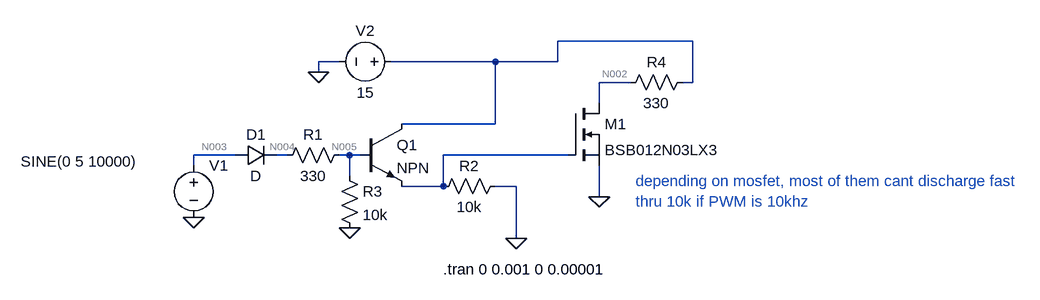
[diagram p0: schematic MOSFET_gate_discharge_via_pull_down.asc]
MOSFET_gate_discharge_via_pull_down.asc, the LTspice schematic file:
Version 4
SHEET 1 1380 680
WIRE 720 -16 512 -16
WIRE 176 16 144 16
WIRE 416 16 256 16
WIRE 512 16 512 -16
WIRE 512 16 416 16
WIRE 144 32 144 16
WIRE 624 48 576 48
WIRE 720 48 720 -16
WIRE 720 48 704 48
WIRE 576 80 576 48
WIRE 416 112 416 16
WIRE 416 112 272 112
WIRE 16 160 -48 160
WIRE 96 160 80 160
WIRE 192 160 176 160
WIRE 208 160 192 160
WIRE 528 160 336 160
WIRE -48 176 -48 160
WIRE 192 192 192 160
WIRE 336 208 336 160
WIRE 336 208 272 208
WIRE 448 208 416 208
WIRE 576 224 576 176
WIRE 448 288 448 208
FLAG -48 256 0
FLAG 144 32 0
FLAG 448 288 0
FLAG 192 272 0
FLAG 576 224 0
SYMBOL voltage -48 160 R0
WINDOW 3 -266 10 Left 2
WINDOW 123 0 0 Left 0
WINDOW 39 0 0 Left 0
SYMATTR Value SINE(0 5 10000)
SYMATTR InstName V1
SYMBOL res 192 144 R90
WINDOW 0 0 56 VBottom 2
WINDOW 3 32 56 VTop 2
SYMATTR InstName R1
SYMATTR Value 330
SYMBOL res 432 192 R90
WINDOW 0 0 56 VBottom 2
WINDOW 3 32 56 VTop 2
SYMATTR InstName R2
SYMATTR Value 10k
SYMBOL npn 208 112 R0
SYMATTR InstName Q1
SYMBOL diode 16 176 R270
WINDOW 0 32 32 VTop 2
WINDOW 3 0 32 VBottom 2
SYMATTR InstName D1
SYMBOL voltage 272 16 R90
WINDOW 0 -32 56 VBottom 2
WINDOW 3 32 56 VTop 2
WINDOW 123 0 0 Left 0
WINDOW 39 0 0 Left 0
SYMATTR InstName V2
SYMATTR Value 15
SYMBOL res 176 176 R0
SYMATTR InstName R3
SYMATTR Value 10k
SYMBOL nmos 528 80 R0
SYMATTR InstName M1
SYMATTR Value BSB012N03LX3
SYMBOL res 720 32 R90
WINDOW 0 0 56 VBottom 2
WINDOW 3 32 56 VTop 2
SYMATTR InstName R4
SYMATTR Value 330
TEXT 336 336 Left 2 !.tran 0 0.001 0 0.00001
TEXT 632 200 Left 2 ;depending on mosfet, most of them cant discharge fast\nthru 10k if PWM is 10khz

The netlist it stands for:
* MOSFET_gate_discharge_via_pull_down.asc
V1 N003 0 SINE(0 5 10000)
R1 N005 N004 330
R2 0 N006 10k
Q1 N001 N005 N006 0 NPN
D1 N003 N004 D
V2 N001 0 15
R3 N005 0 10k
M1 N002 N006 0 0 BSB012N03LX3
R4 N001 N002 330
.model D D
.lib standard.dio
.model NPN NPN
.model PNP PNP
.lib standard.bjt
.model NMOS NMOS
.model PMOS PMOS
.lib standard.mos
.tran 0 0.001 0 0.00001
* depending on mosfet, most of them cant discharge fast
* thru 10k if PWM is 10khz
.backanno
.end

* Results of the author's LTspice run, read from the files saved beside the schematic
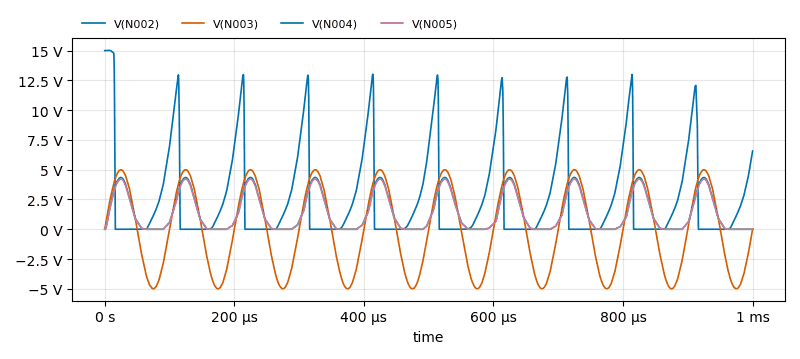
[diagram p1: Transient Analysis of MOSFET_gate_discharge_via_pull_down.asc, plotted from the saved traces]
* Transient Analysis, 1 run:
*   V(N002): min 95.77 µV, max 15.02 V, average 2.569 V, rms 4.693 V, last 6.569 V
*   V(N003): min -5 V, max 4.999 V, average 1.511 mV, rms 3.588 V, last 0 V
*   V(N004): min 0 V, max 4.352 V, average 1.397 V, rms 2.13 V, last 0 V
*   V(N005): min 0 V, max 4.211 V, average 1.351 V, rms 2.06 V, last 0 V